# EAGLE design IntegratedSensor (EAGLE 6.3)
Menlo Park Innovation LLC Sensor Front End Electronics
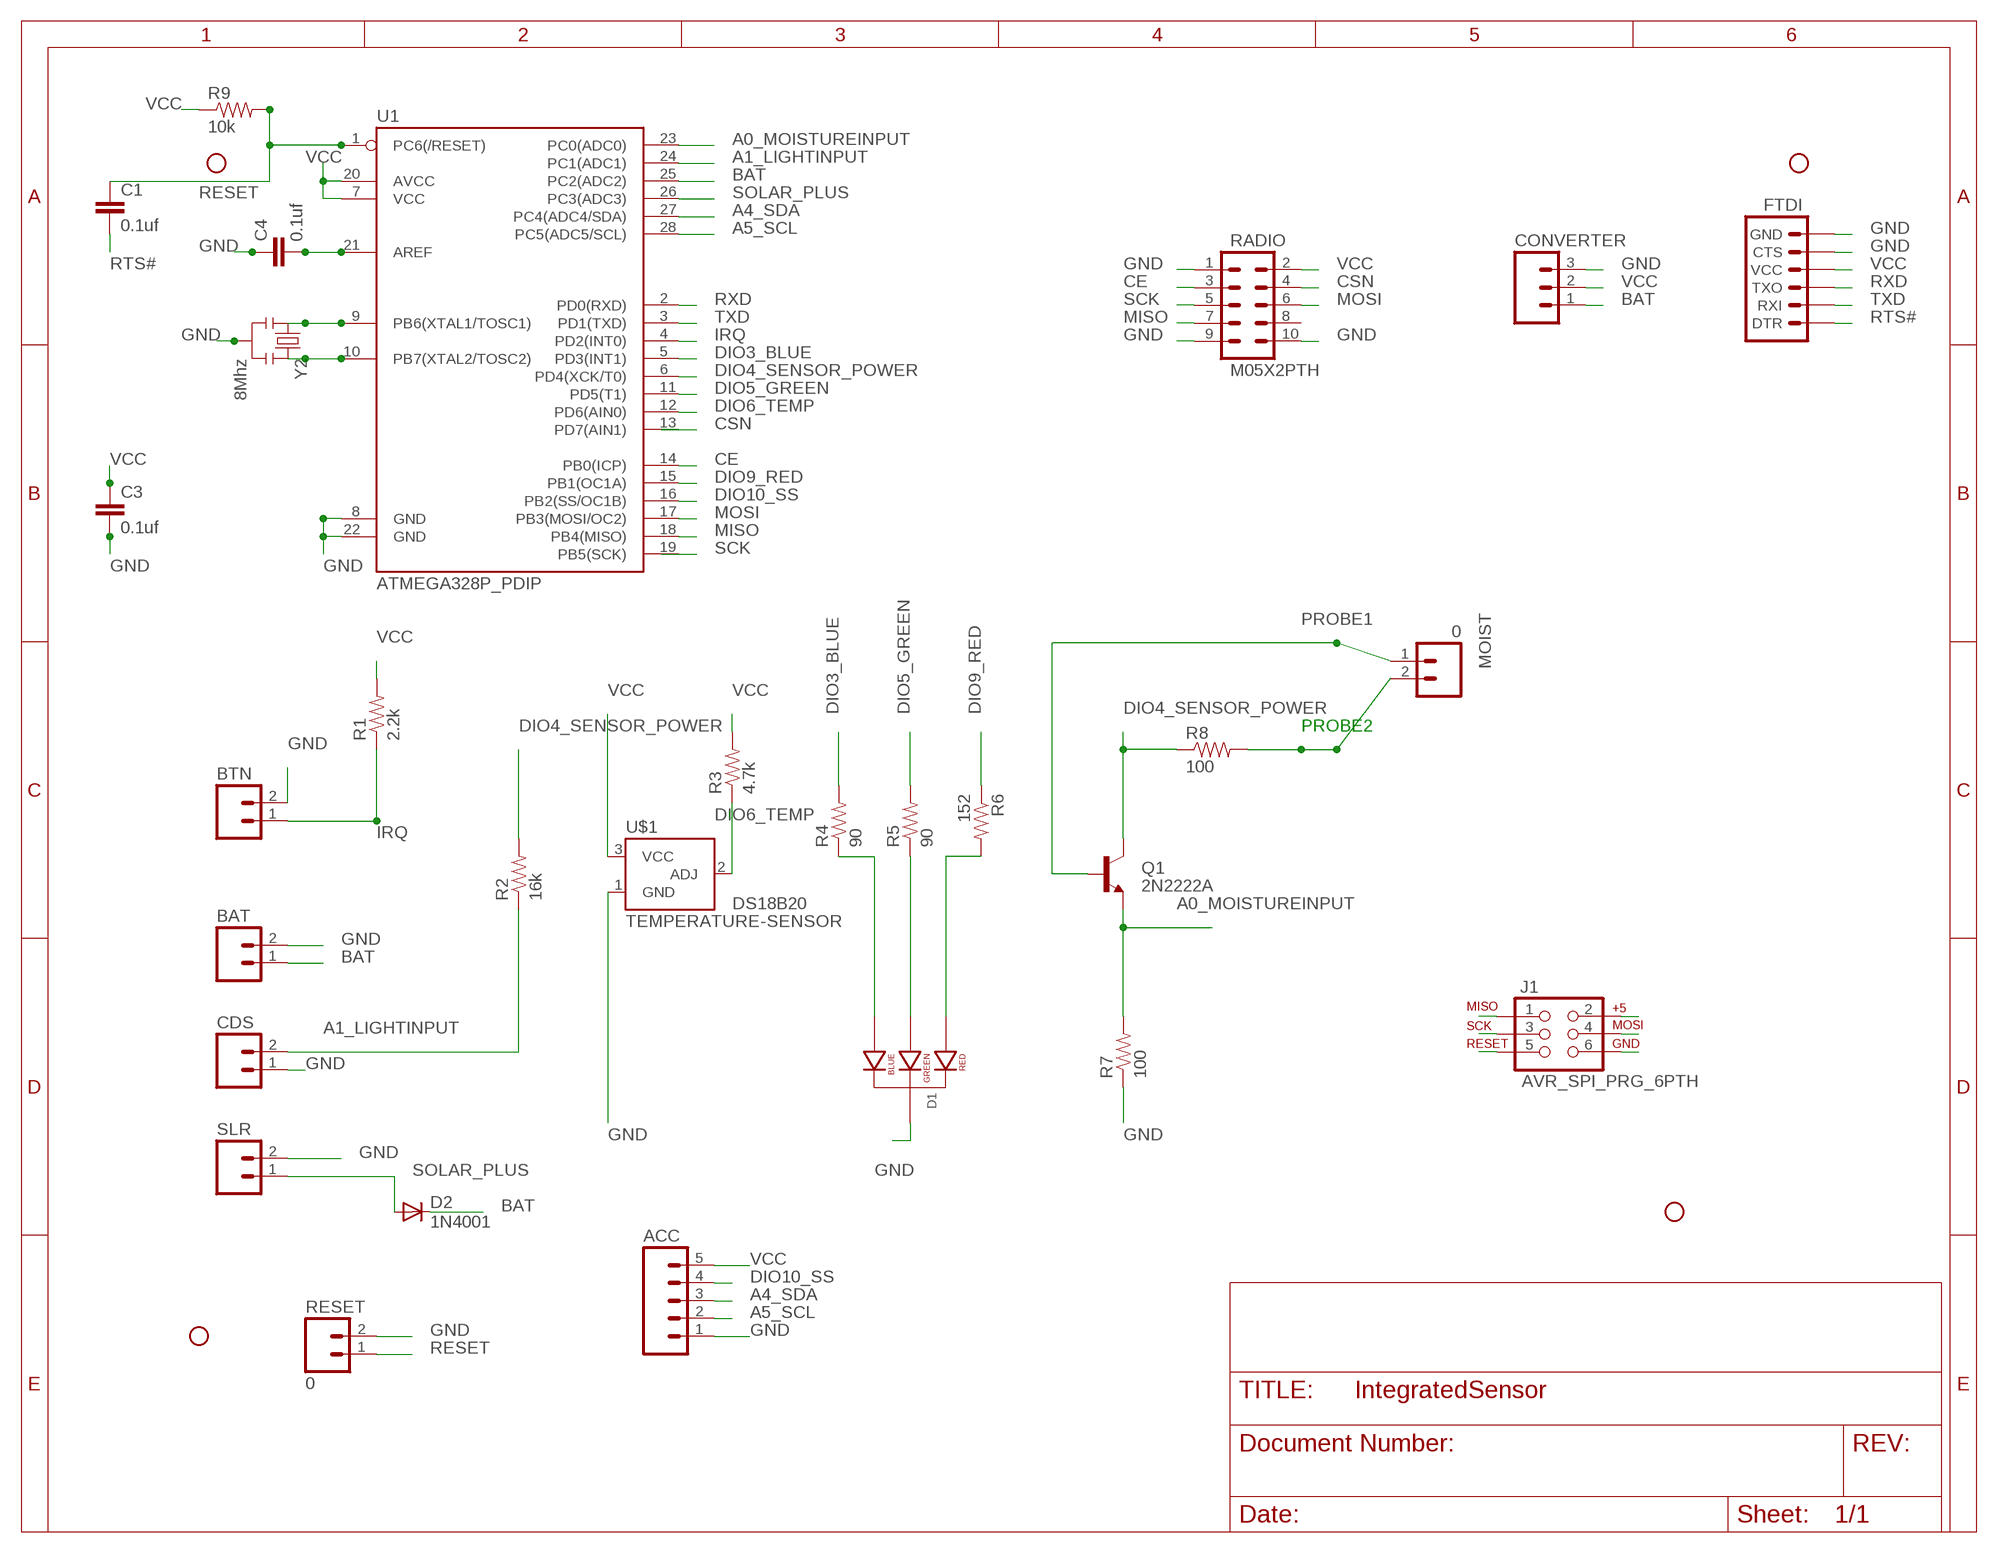
[diagram p0: schematic, sheet 1]

## Parts
ACC  M05PTH  [1X05]
BAT  M02PTH  [1X02]
BTN  M02PTH  [1X02]
C1  0.1uf  CAPPTH  [CAP-PTH-SMALL]
C3  0.1uf  CAPPTH  [CAP-PTH-SMALL]
C4  0.1uf  CAPPTH  [CAP-PTH-SMALL]
CDS  M02PTH  [1X02]
CONVERTER  M03PTH  [1X03]
D1  LED-RGB-CC-THRUCLEAR  [LED-RGB-THRU]
D2  1N4001  DIODEPTH  [DIODE-1N4001]
FTDI  ARDUINO_SERIAL_PROGRAMPTH  [1X06]
J1  AVR_SPI_PRG_6PTH  [2X3]
MOIST  0  M02PTH  [1X02]
Q1  2N2222A  TRANSISTOR_NPNTO-92-AMMO  [TO-92-AMMO]
R1  2.2k  RESISTORPTH-1/6W  [1/6W-RES]
R2  16k  RESISTORPTH-1/6W  [1/6W-RES]
R3  4.7k  RESISTORPTH-1/6W  [1/6W-RES]
R4  90  RESISTORPTH-1/6W  [1/6W-RES]
R5  90  RESISTORPTH-1/6W  [1/6W-RES]
R6  152  RESISTORPTH-1/6W  [1/6W-RES]
R7  100  RESISTORPTH-1/6W  [1/6W-RES]
R8  100  RESISTORPTH-1/6W  [1/6W-RES]
R9  10k  RESISTORPTH-1/6W  [1/6W-RES]
RADIO  M05X2PTH  [AVR_ICSP]
RESET  0  M02PTH  [1X02]
SLR  M02PTH  [1X02]
STANDOFF1  STAND-OFF  [STAND-OFF]
STANDOFF2  STAND-OFF  [STAND-OFF]
STANDOFF3  STAND-OFF  [STAND-OFF]
STANDOFF4  STAND-OFF  [STAND-OFF]
U1  ATMEGA328P_PDIP  [DIL28-3]
U$1  TEMPERATURE-SENSOR  [TO-92]
Y2  8Mhz  RESONATORPTH  [RESONATOR-PTH]

## Nets
A0_MOISTUREINPUT: Q1.1(E) R7.2 U1.23(PC0(ADC0))
A1_LIGHTINPUT: CDS.2 R2.1 U1.24(PC1(ADC1))
A4_SDA: ACC.3 U1.27(PC4(ADC4/SDA))
A5_SCL: ACC.2 U1.28(PC5(ADC5/SCL))
BAT: BAT.1 CONVERTER.1 D2.C U1.25(PC2(ADC2))
CE: RADIO.3 U1.14(PB0(ICP))
CSN: RADIO.4
DIO3_BLUE: R4.2 U1.5(PD3(INT1))
DIO4_SENSOR_POWER: Q1.3(C) R2.2 R8.1 U1.6(PD4(XCK/T0))
DIO5_GREEN: R5.2 U1.11(PD5(T1))
DIO6_TEMP: R3.1 U1.12(PD6(AIN0)) U$1.2(ADJ)
DIO9_RED: R6.1 U1.15(PB1(OC1A))
DIO10_SS: ACC.4 U1.16(PB2(SS/OC1B))
GND: ACC.1 BAT.2 BTN.2 C3.2 C4.1 CDS.1 CONVERTER.3 D1.2(CATHODE) FTDI.5(CTS) FTDI.6(GND) J1.6 R7.1 RADIO.1 RADIO.9 RADIO.10 RESET.2 SLR.2 U1.8(GND) U1.22(GND) U$1.1(GND) Y2.2
IRQ: BTN.1 R1.1 U1.4(PD2(INT0))
MISO: J1.1 RADIO.7 U1.18(PB4(MISO))
MOSI: J1.4 RADIO.6 U1.17(PB3(MOSI/OC2))
N$1: D1.4(BLUE_CATHODE) R4.1
N$2: D1.3(GREEN_CATHODE) R5.1
N$3: D1.1(RED_CATHODE) R6.2
N$5: U1.9(PB6(XTAL1/TOSC1)) Y2.1
N$6: U1.10(PB7(XTAL2/TOSC2)) Y2.3
N$8: C4.2 U1.21(AREF)
PROBE1: MOIST.1 Q1.2(B)
PROBE2: MOIST.2 R8.2
RESET: C1.1 J1.5 R9.2 RESET.1 U1.1(PC6(/RESET))
RTS#: C1.2 FTDI.1(DTR)
RXD: FTDI.3(TXO) U1.2(PD0(RXD))
SCK: J1.3 RADIO.5
SOLAR_PLUS: D2.A SLR.1 U1.26(PC3(ADC3))
TXD: FTDI.2(RXI) U1.3(PD1(TXD))
VCC: ACC.5 C3.1 CONVERTER.2 FTDI.4(VCC) J1.2 R1.2 R3.2 R9.1 RADIO.2 U1.7(VCC) U1.20(AVCC) U$1.3(VCC)
Unconnected: RADIO.8 U1.13(PD7(AIN1)) U1.19(PB5(SCK))

## Library data of the parts
ACC = SparkFun-Connectors:M05: Header 5 Standard 5-pin 0.1" header. Use with straight break away headers (SKU : PRT-00116), right angle break away headers (PRT-00553), swiss pins (PRT-00743), machine pins (PRT-00117), and female headers (PRT-00115). Molex polarized connector foot print use with SKU : PRT-08230 with associated crimp pins and housings.
BAT BTN CDS MOIST RESET SLR = SparkFun-Connectors:M02: Header 2 Standard 2-pin 0.1" header. Use with straight break away headers (SKU : PRT-00116), right angle break away headers (PRT-00553), swiss pins (PRT-00743), machine pins (PRT-00117), and female headers (PRT-00115). Molex polarized connector foot print use with SKU : PRT-08233 with associated crimp pins and housings.
C1 C3 C4 = SparkFun-Capacitors:CAP: Capacitor Standard 0603 ceramic capacitor, and 0.1" leaded capacitor.
CONVERTER = SparkFun-Connectors:M03: Header 3 Standard 3-pin 0.1" header. Use with straight break away headers (SKU : PRT-00116), right angle break away headers (PRT-00553), swiss pins (PRT-00743), machine pins (PRT-00117), and female headers (PRT-00115). Molex polarized connector foot print use with SKU : PRT-08232 with associated crimp pins and housings.
D1 = SparkFun-LED:LED-RGB-CC-THRU: RGB Through-hole common cathode LED SparkFun Storefront: COM-00105 (Clear) COM-09264 (Diffuse); PROD_ID: DIO-08418
D2 = SparkFun-DiscreteSemi:DIODE: Diode These are standard reverse protection diodes and small signal diodes. SMA package can handle up to about 1A. SOD-323 can handle about 200mA. What the SOD-323 package when ordering, there are some mfgs out there that are 5-pin packages.
FTDI = SparkFun-Connectors:ARDUINO_SERIAL_PROGRAM: FTDI connector footprints
J1 = SparkFun-Connectors:AVR_SPI_PRG_6: AVR ISP 6 Pin This is the reduced ISP connector for AVR programming. Common on Arduino. This footprint will take up less PCB space and can be used with a 10-pin to 6-pin adapter such as SKU: BOB-08508
Q1 = SparkFun-DiscreteSemi:TRANSISTOR_NPN: Generic NPN BJT. MMBT2222 is the common NPN we use. Double check against datasheet- not all devices are the same!
R1-R9 = SparkFun-Resistors:RESISTOR: Resistor Basic schematic elements and footprints for 0603, 1206, and PTH resistors.
RADIO = SparkFun-Connectors:M05X2: Header 5x2 Standard 10-pin dual row 0.1" header. Commonly used with AVR-ISP. Use with Spark Fun Electronics SKU: PRT-00778
STANDOFF1-STANDOFF4 = SparkFun-Electromechanical:STAND-OFF: #4 Stand Off This is the mechanical footprint for a #4 phillips button head screw. Use the keepout ring to avoid running the screw head into surrounding components. SKU : PRT-00447
U1 = SparkFun-DigitalIC:ATMEGA328P_PDIP: uC used in the Arduino 32kb flash, 1k EEPROM, 2k SRAM This is the through-hole version of this chip.
U$1 = SparkFun-Sensors:TEMPERATURE-SENSOR: TO-92 temp sensor; PARTNAME: DS18B20
Y2 = SparkFun-FreqCtrl:RESONATOR: Resonator Small SMD resonator. Used, eg, on the Arduino Pro/ Pro Mini boards. 8MHz- XTAL-08895 16MHz- XTAL-08900

## Board
MenloSensor1
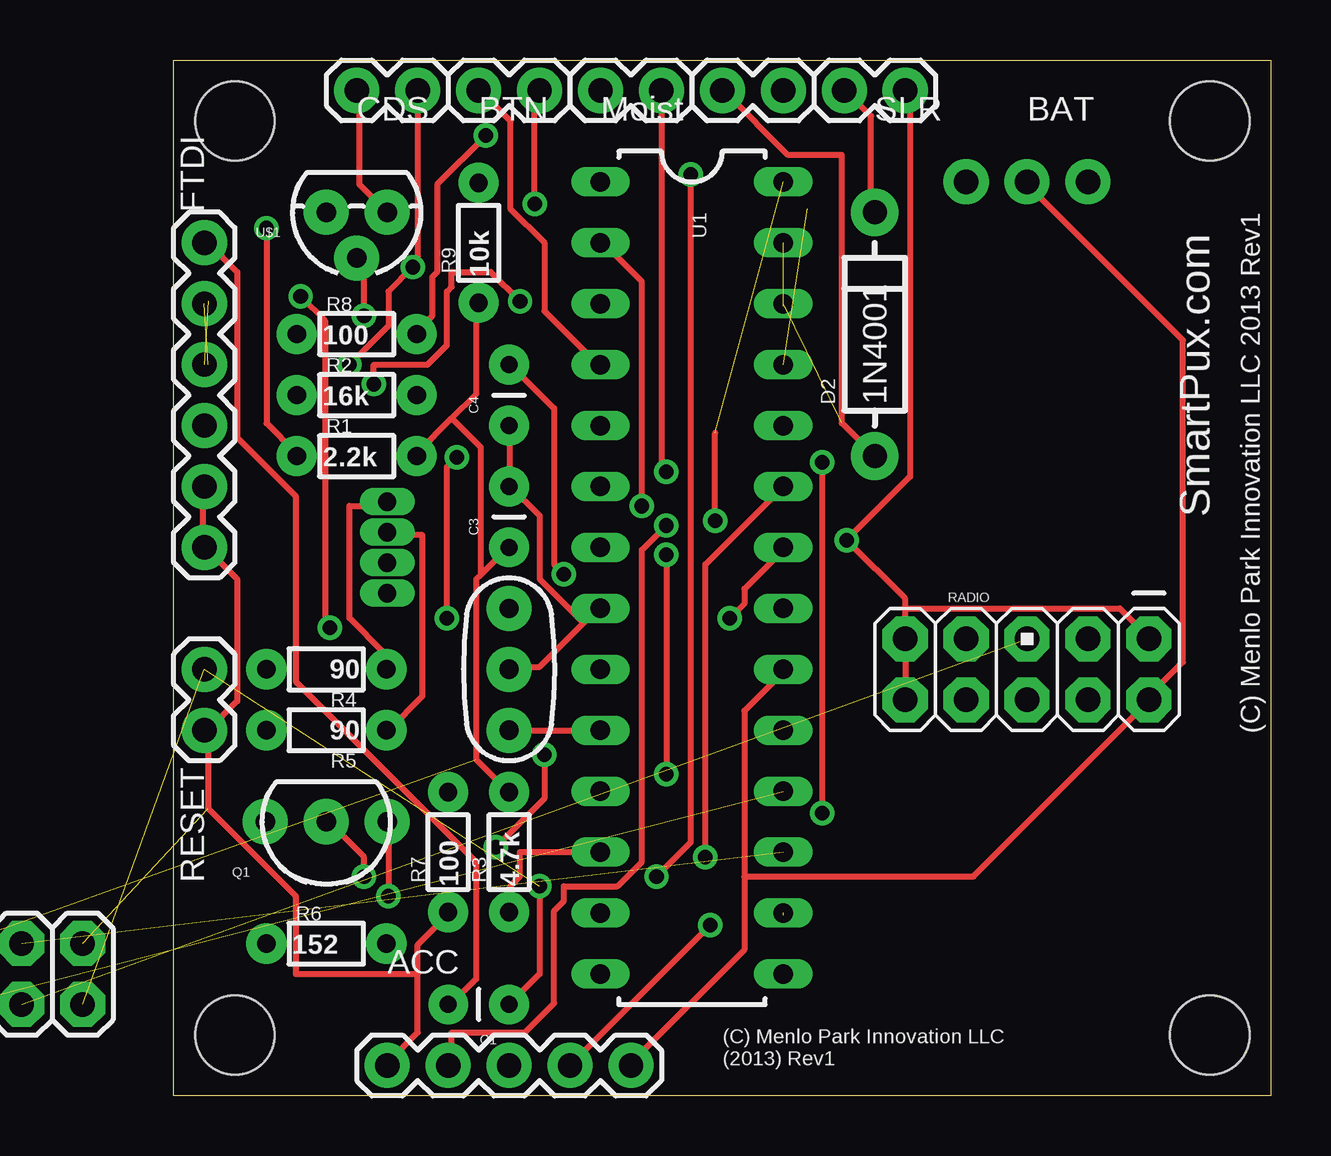
[diagram p1: board, top side]
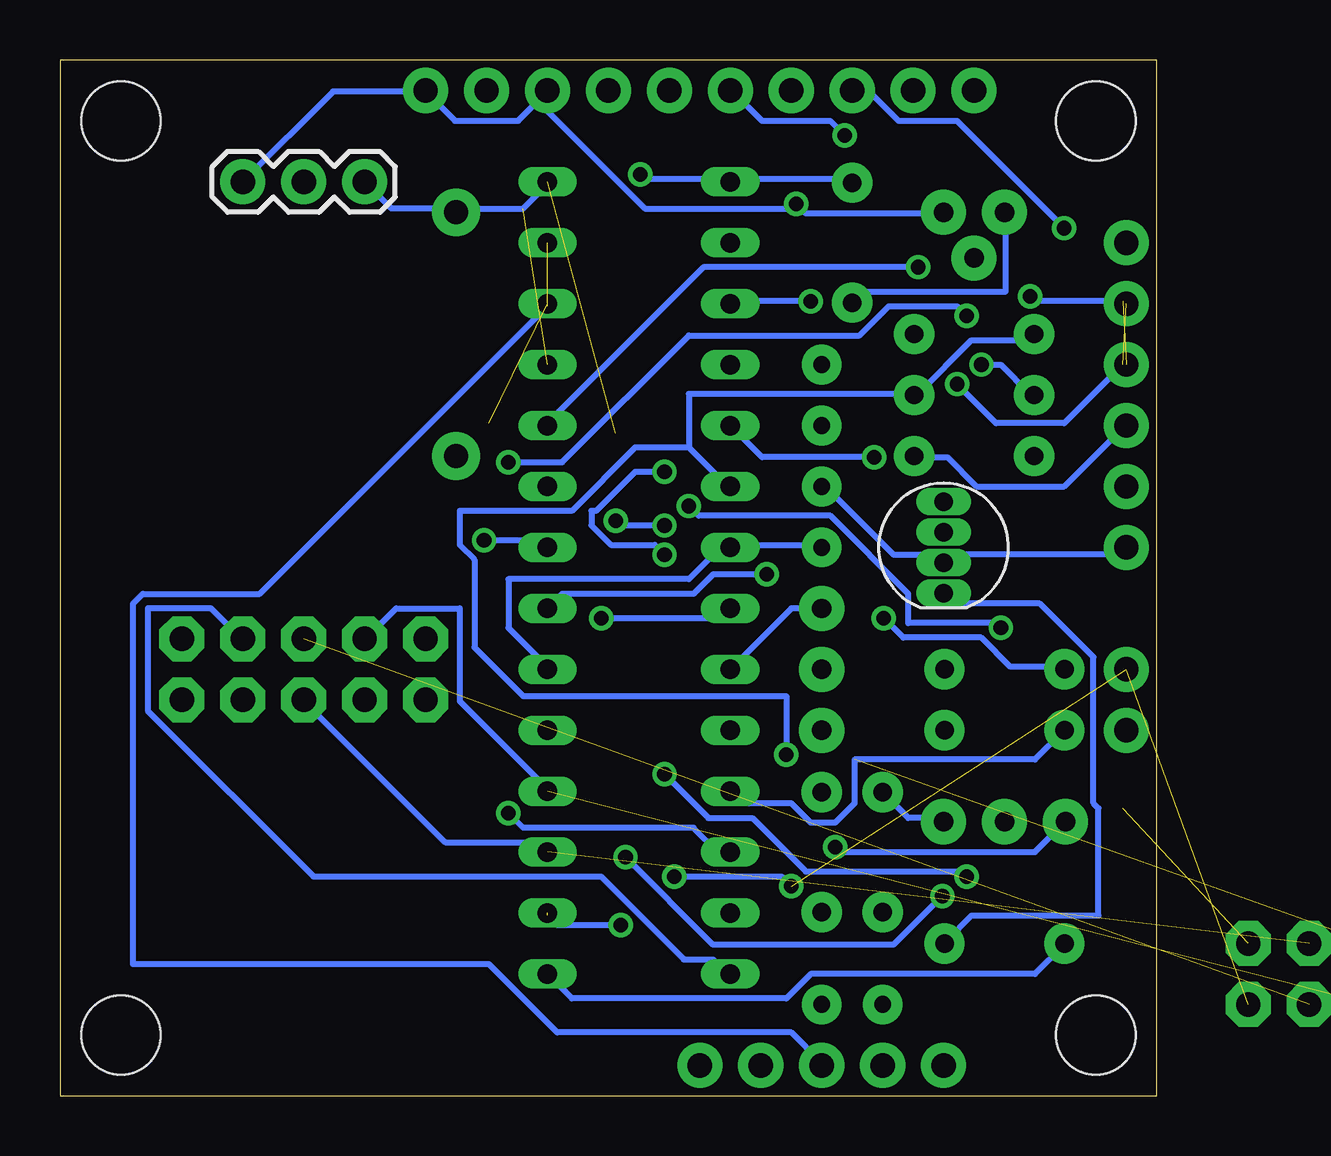
[diagram p2: board, bottom side, seen from below]

Size 45.72 x 43.18 mm. Coordinates in mm from the lower left corner, seen from the top.
Outline: 0,0 0,43.18 45.72,43.18 45.72,0 0,0
Copper layers (1*16): Top 0.035mm / dielectric 1.5mm / Bottom 0.035mm
Design rules "default *": minimum track width 10mil, minimum drill 24mil, track to track 8mil, track to pad 8mil, pad to pad 8mil, via to via 8mil, smd to smd 8mil, copper to edge 40mil, drill to drill 8mil, minimum pad ring 0mil, minimum via ring 8mil, stop-mask expansion 4mil, vias tented up to drill 0mil, thermal gap 10mil

### Footprints (pad centres in the part's own frame; a part is rotated, then mirrored left to right if it is on the bottom)
1X05 = drill 1.016 pad 1.88: 1 0,0; 2 2.54,0; 3 5.08,0; 4 7.62,0; 5 10.16,0
1X02 = drill 1.016 pad 1.88: 1 0,0; 2 2.54,0
CAP-PTH-SMALL = drill 0.7 pad 1.651: 1 0,0; 2 2.54,0
1X03 = drill 1.016 pad 1.88: 1 0,0; 2 2.54,0; 3 5.08,0
LED-RGB-THRU = drill 0.762 pad 0.889 long: 1 1.905,0; 2 0.635,0; 3 -0.635,0; 4 -1.905,0
DIODE-1N4001 = drill 1 pad 1.981: A -5.08,0; C 5.08,0
1X06 = drill 1.016 pad 1.88: 1 0,0; 2 2.54,0; 3 5.08,0; 4 7.62,0; 5 10.16,0; 6 12.7,0
2X3 = drill 1.016 pad 1.88 octagon: 1 0,0; 2 0,2.54; 3 2.54,0; 4 2.54,2.54; 5 5.08,0; 6 5.08,2.54
TO-92-AMMO = drill 0.813 pad 1.88: 1 -2.54,0; 2 0,0; 3 2.54,0
1/6W-RES = drill 0.762 pad 1.676: 1 -2.5,0; 2 2.5,0
AVR_ICSP = drill 1.016 pad 1.88 octagon: 1 -1.27,5.08; 2 1.27,5.08; 3 -1.27,2.54; 4 1.27,2.54; 5 -1.27,0; 6 1.27,0; 7 -1.27,-2.54; 8 1.27,-2.54; 9 -1.27,-5.08; 10 1.27,-5.08
STAND-OFF = hole 3.302: 0,0
DIL28-3 = drill 0.813 long: 1 -16.51,-3.81; 2 -13.97,-3.81; 3 -11.43,-3.81; 4 -8.89,-3.81; 5 -6.35,-3.81; 6 -3.81,-3.81; 7 -1.27,-3.81; 8 1.27,-3.81; 9 3.81,-3.81; 10 6.35,-3.81; 11 8.89,-3.81; 12 11.43,-3.81; 13 13.97,-3.81; 14 16.51,-3.81; 15 16.51,3.81; 16 13.97,3.81; 17 11.43,3.81; 18 8.89,3.81; 19 6.35,3.81; 20 3.81,3.81; 21 1.27,3.81; 22 -1.27,3.81; 23 -3.81,3.81; 24 -6.35,3.81; 25 -8.89,3.81; 26 -11.43,3.81; 27 -13.97,3.81; 28 -16.51,3.81
TO-92 = drill 0.813 pad 1.88: 1 -1.27,0; 2 0,1.905; 3 1.27,0
RESONATOR-PTH = drill 0.8 pad 1.88: 1 -2.54,0; 2 0,0; 3 2.54,0

### Placement (x,y rotation side)
ACC  8.89,1.27 0 top
BAT  27.94,41.91 0 top
BTN  12.7,41.91 0 top
C1  13.97,3.81 180 top
C3  13.97,22.86 90 top
C4  13.97,27.94 90 top
CDS  7.62,41.91 0 top
CONVERTER  33.02,38.1 180 bottom
D1  8.89,22.86 270 bottom
D2  29.21,31.75 90 top
FTDI  1.27,35.56 270 top
J1  -8.89,3.81 0 top  (outside the outline)
MOIST  20.32,41.91 180 top
Q1  6.35,11.43 180 top
R1  7.62,26.67 0 top
R2  7.62,29.21 0 top
R3  13.97,10.16 90 top
R4  6.35,17.78 180 top
R5  6.35,15.24 180 top
R6  6.35,6.35 0 top
R7  11.43,10.16 90 top
R8  7.62,31.75 0 top
R9  12.7,35.56 90 top
RADIO  35.56,17.78 270 top
RESET  1.27,17.78 270 top
SLR  22.86,41.91 0 top
STANDOFF1  43.18,40.64 0 top
STANDOFF2  2.54,40.64 0 top
STANDOFF3  2.54,2.54 0 top
STANDOFF4  43.18,2.54 0 top
U1  21.59,21.59 270 top
U$1  7.62,36.83 180 top
Y2  13.97,17.78 270 top

### Tracks (layer width: path | path; a pad name or v marks a point on that pad's centre or on a via)
A0_MOISTUREINPUT  (via drill 0.61)
  Top 0.254: U1.23 22.15,22.15 v22.15,9.96 | v8.94,8.33 8.94,11.38 Q1.1
  Bottom 0.254: v22.15,9.96 18.49,6.3 10.97,6.3 v8.94,8.33 | R7.2 11.38,12.6 10.36,11.58 8.94,11.58 Q1.1
A1_LIGHTINPUT  (via drill 0.61)
  Top 0.254: CDS.2 10.16,34.75 v9.96,34.54 8.94,33.53 8.94,32.11 v7.32,30.48
  Bottom 0.254: v9.96,34.54 18.9,34.54 25.4,28.04 U1.24 | v7.32,30.48 6.5,30.48 5.28,29.26 R2.1
A4_SDA  (1 unrouted)
  Bottom 0.254: 25.4,32.92 37.39,20.93 42.27,20.93 42.67,20.52 42.67,5.49 27.84,5.49 24.99,2.64 15.24,2.64 14.02,1.42 ACC.3
A5_SCL  (via drill 0.61)  (1 unrouted)
  Top 0.254: v22.55,23.98 22.55,27.64 | v20.52,23.77 19.51,22.76 19.51,9.75 18.49,8.74 16.26,8.74 16.26,8.13 15.85,7.72 15.85,3.86 14.63,2.64 11.58,2.64 11.58,1.42 ACC.2
  Bottom 0.254: v22.55,23.98 22.35,23.77 v20.52,23.77
BAT  (1 unrouted)
  Top 0.254: BAT.1 28.04,41.86 29.06,40.84 29.06,36.98 D2.C
  Bottom 0.254: 25.4,38 26.42,36.98 29.06,36.98 D2.C 29.26,36.98 31.9,36.98 CONVERTER.1
CE
  Bottom 0.254: U1.14 17.88,5.08 18.49,5.69 19.71,5.69 23.16,9.14 35.15,9.14 42.06,16.05 42.06,20.32 39.42,20.32 38.2,19.1 RADIO.3
DIO3_BLUE  (via drill 0.61)
  Top 0.254: v11.79,26.62 11.38,26.21 v11.38,19.91
  Bottom 0.254: U1.5 16.46,26.62 v11.79,26.62 | v11.38,19.91 10.57,19.1 7.32,19.1 6.1,17.88 3.86,17.88 R4.2
DIO4_SENSOR_POWER  (via drill 0.61)
  Top 0.254: v13.41,10.36 15.44,12.39 v15.44,14.22
  Bottom 0.254: 19.51,27.03 17.88,25.4 U1.6 | 19.51,27.03 19.51,29.26 10.16,29.26 R2.2 9.96,29.26 7.72,31.5 5.49,31.5 5.28,31.7 R8.1 | Q1.3 5.08,10.16 13.21,10.16 v13.41,10.36 | v15.44,14.22 15.44,16.66 26.42,16.66 28.45,18.69 28.45,22.35 29.06,22.96 29.06,24.38 24.38,24.38 21.74,27.03 19.51,27.03
DIO5_GREEN
  Bottom 0.254: U1.11 17.27,12.19 15.24,12.19 14.43,11.38 13.41,11.38 12.6,12.19 12.6,14.02 5.08,14.02 3.86,15.24 R5.2
DIO6_TEMP  (via drill 0.61)
  Top 0.254: U1.12 14.43,10.16 14.43,9.14 14.02,8.74 14.02,7.72 R3.1 | v7.92,32.51 7.92,34.54 7.72,34.75 U$1.2 | v27.03,11.79 v27.03,26.42
  Bottom 0.254: v7.92,32.51 8.33,32.92 11.18,32.92 12.39,31.7 19.51,31.7 24.79,26.42 v27.03,26.42 | v27.03,11.79 26.42,11.18 19.3,11.18 18.29,10.16 U1.12
DIO9_RED
  Bottom 0.254: U1.15 24.38,4.06 15.44,4.06 14.43,5.08 5.08,5.08 3.86,6.3 R6.1
DIO10_SS  (via drill 0.61)  (1 unrouted)
  Top 0.254: ACC.4 v22.35,7.11
  Bottom 0.254: 25.4,7.52 24.99,7.11 v22.35,7.11
GND  (via drill 0.61)  (1 unrouted)
  Top 0.254: 17.07,19.71 15.24,17.88 14.02,17.88 Y2.2 | 17.07,19.71 17.68,20.32 U1.8 | 14.02,25.4 14.02,27.84 C4.1 | 17.07,19.71 15.24,21.54 15.24,24.18 14.02,25.4 | 14.02,25.4 C3.2 | 10.16,5.08 10.16,2.64 8.94,1.42 ACC.1 | 10.16,5.08 10.16,6.3 11.38,7.52 R7.1 | 1.42,15.24 2.64,16.46 2.64,21.54 1.42,22.76 FTDI.6 1.22,22.96 1.22,25.4 FTDI.5 | 10.16,5.08 5.08,5.08 5.08,8.33 1.42,11.99 1.42,15.24 | 1.42,15.24 RESET.2 | 30.48,20.32 RADIO.9 RADIO.10 | 30.48,20.32 30.48,20.73 v28.04,23.16 30.68,25.81 30.68,41.66 30.48,41.86 BAT.2 | 30.48,20.32 39.42,20.32 40.64,19.1 RADIO.1 | U$1.1 7.72,38 7.72,41.86 CDS.1 | v15.04,37.19 15.04,41.66 15.24,41.86 BTN.2 | v23.16,19.91 23.77,20.52 23.77,21.13 25.4,22.76 U1.22
  Bottom 0.254: C3.2 13.82,25.4 10.97,22.55 9.14,22.55 8.94,22.35 D1.2 8.74,22.35 8.53,22.55 1.63,22.55 1.42,22.76 FTDI.6 | v28.04,23.16 25.6,23.16 25.4,22.96 U1.22 | U$1.1 8.94,36.78 14.63,36.78 v15.04,37.19 15.24,36.98 21.34,36.98 25.81,41.45 | 25.81,41.45 26.62,40.64 29.26,40.64 30.48,41.86 | 25.81,41.45 25.4,41.86 SLR.2 25.81,41.45 | CONVERTER.3 34.34,41.86 30.48,41.86 | 30.48,41.86 BAT.2 | v23.16,19.91 18.29,19.91 17.88,20.32 U1.8
IRQ  (via drill 0.61)
  Top 0.254: U1.4 17.68,30.48 15.44,32.72 15.44,35.56 14.02,36.98 14.02,40.64 12.8,41.86 BTN.1 | v3.86,36.17 3.86,28.04 5.08,26.82 R1.1
  Bottom 0.254: v3.86,36.17 8.33,40.64 10.77,40.64 11.99,41.86 12.6,41.86 BTN.1
MISO  (1 unrouted)
  Bottom 0.254: U1.18 25.4,12.8 29.06,16.46 29.06,20.32 31.7,20.32 32.92,19.1 RADIO.7
MOSI  (1 unrouted)
  Bottom 0.254: U1.17 25.81,10.57 29.67,10.57 35.56,16.46 RADIO.6
N$1
  Top 0.254: D1.4 8.74,24.59 7.32,24.59 7.32,19.91 8.74,18.49 8.74,17.88 R4.1
N$2
  Top 0.254: D1.3 8.94,23.37 10.36,23.37 10.36,16.66 8.94,15.24 R5.1
N$3
  Bottom 0.254: D1.1 8.74,20.93 8.33,20.52 4.88,20.52 2.64,18.29 2.64,12.19 2.44,11.99 2.44,7.52 7.72,7.52 8.74,6.5 R6.2
N$5
  Bottom 0.254: U1.9 15.24,20.32 Y2.1
N$6
  Top 0.254: Y2.3 U1.10
N$8  (via drill 0.61)
  Top 0.254: v16.26,21.74 15.85,22.15 15.85,28.65 14.02,30.48 C4.2
  Bottom 0.254: U1.21 24.79,20.93 19.3,20.93 18.49,21.74 v16.26,21.74
PROBE1  (via drill 0.61)
  Top 0.254: v7.92,9.14 7.92,9.96 6.5,11.38 Q1.2 | v20.52,22.55 v20.52,13.41 | v20.52,26.01 20.32,26.21 MOIST.1
  Bottom 0.254: v7.92,9.14 8.13,9.35 14.63,9.35 16.87,11.58 18.69,11.58 v20.52,13.41 | v20.52,22.55 20.93,22.96 22.76,22.96 23.57,23.77 23.57,24.38 23.37,24.38 21.74,26.01 v20.52,26.01
PROBE2  (via drill 0.61)
  Top 0.254: v13.01,40.03 10.97,38 10.97,34.34 10.77,34.14 10.77,32.51 10.16,31.9 R8.2
  Bottom 0.254: v13.01,40.03 13.61,40.64 16.46,40.64 17.68,41.86 MOIST.2
RESET  (via drill 0.61)  (2 unrouted)
  Top 0.254: C1.1 15.24,5.08 v15.24,8.74 | v20.12,9.14 21.54,10.57 v21.54,38.41
  Bottom 0.254: R9.2 12.8,38.2 17.68,38.2 U1.1 17.88,38.2 21.34,38.2 v21.54,38.41 | v15.24,8.74 15.65,9.14 v20.12,9.14
RTS#
  Top 0.254: C1.2 11.58,3.86 12.6,4.88 12.6,9.75 5.08,17.27 5.08,24.99 2.64,27.43 2.64,34.34 1.42,35.56 FTDI.1
RXD  (via drill 0.61)  (1 unrouted)
  Top 0.254: v19.51,24.59 19.51,33.93 17.88,35.56 U1.2 | v6.5,19.51 6.3,19.71 6.3,32.31 v5.28,33.33
  Bottom 0.254: v19.51,24.59 19.1,24.18 13.61,24.18 10.36,20.93 10.36,19.71 6.71,19.71 v6.5,19.51 | v5.28,33.33 5.08,33.12 1.42,33.12
SCK  (1 unrouted)
SOLAR_PLUS  (1 unrouted)
  Top 0.254: D2.A 27.84,28.04 27.84,39.22 25.6,39.22 22.96,41.86 SLR.1
TXD  (via drill 0.61)  (1 unrouted)
  Top 0.254: v14.43,33.12 13.21,34.34 11.58,34.34 11.58,33.73 11.38,33.53 11.38,31.29 10.57,30.48 8.33,30.48 v8.33,29.67
  Bottom 0.254: v14.43,33.12 17.68,33.12 U1.3 | v8.33,29.67 6.71,28.04 3.86,28.04 1.42,30.48
VCC  (1 unrouted)
  Top 0.254: 11.58,28.25 12.6,29.26 12.6,32.92 R9.1 | 11.58,28.25 10.16,26.82 R1.2 | 12.8,21.74 13.82,22.76 C3.1 | 12.8,21.74 12.6,21.54 12.6,14.02 13.82,12.8 R3.2 | 23.77,9.14 23.77,16.05 25.4,17.68 U1.20 | 23.77,9.14 23.77,6.1 19.1,1.42 ACC.5 | 23.77,9.14 33.33,9.14 40.64,16.46 RADIO.2 40.64,16.66 42.06,18.09 42.06,31.5 35.56,38 CONVERTER.2 | 11.58,28.25 12.8,27.03 12.8,21.74
  Bottom 0.254: FTDI.4 1.42,27.84 3.86,25.4 7.52,25.4 8.74,26.62 9.96,26.62 R1.2 | U$1.3 6.3,36.78 6.3,33.53 12.19,33.53 12.6,33.12 R9.1 | U1.20 25.4,17.88 27.03,19.51 27.03,21.54 19.51,21.54 18.29,22.76 17.88,22.76 U1.7 17.68,22.96 14.02,22.96 C3.1

### Text on the board
tPlace: CDS | BTN | Moist | SLR | BAT | FTDI | (C) Menlo Park Innovation LLC 2013 Rev1 | SmartPux.com | RESET | ACC | (C) Menlo Park Innovation LLC / (2013) Rev1